# EAGLE design TCA8418 rev B (EAGLE 9.6.2)
COMPANY: ADAFRUIT INDUSTRIES; DRAWN: KTOWN; REV: A
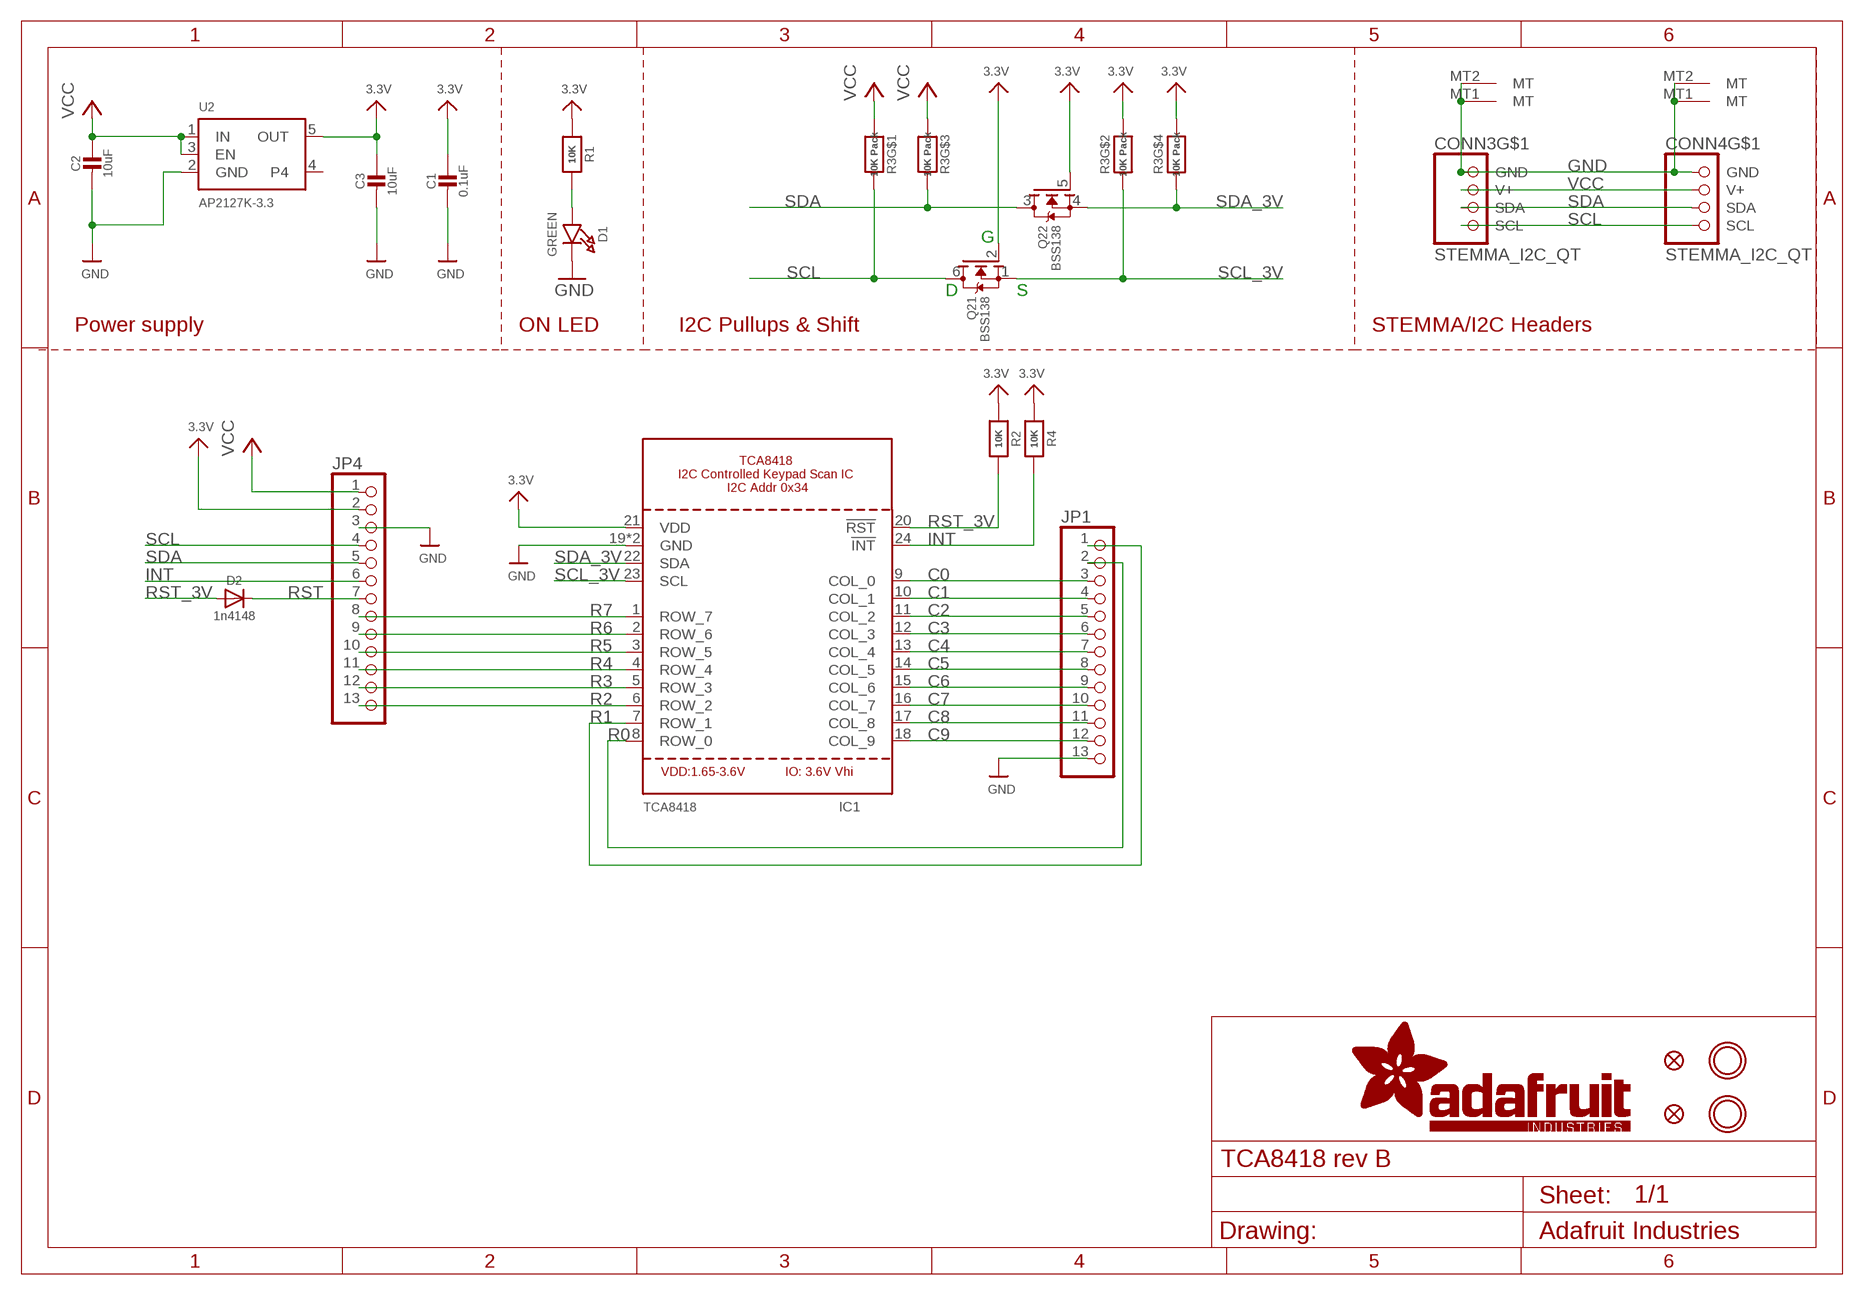
[diagram p0: schematic, sheet 1]

## Parts
C1  0.1uF  CAP_CERAMIC0603_NO  [0603-NO]
C2  10uF  CAP_CERAMIC0805-NOOUTLINE  [0805-NO]
C3  10uF  CAP_CERAMIC0805-NOOUTLINE  [0805-NO]
CONN3  STEMMA_I2C_QT  [JST_SH4]
CONN4  STEMMA_I2C_QT  [JST_SH4]
D1  GREEN  LED0603_NOOUTLINE  [CHIPLED_0603_NOOUTLINE]
D2  1n4148  DIODESOD-323  [SOD-323]
FID3  FIDUCIAL_1MM  [FIDUCIAL_1MM]
FID4  FIDUCIAL_1MM  [FIDUCIAL_1MM]
IC1  TCA8418  [QFN24_4MM_SMSC]
JP1  HEADER-1X13  [1X13_ROUND_70]
JP4  HEADER-1X13  [1X13_ROUND_70]
Q2  BSS138  MOSFET-N_DUAL  [SOT363]
R1  10K  RESISTOR_0603_NOOUT  [0603-NO]
R2  10K  RESISTOR_0603_NOOUT  [0603-NO]
R3  10K Pack  RESISTOR_4PACK  [RESPACK_4X0603]
R4  10K  RESISTOR_0603_NOOUT  [0603-NO]
U2  AP2127K-3.3  VREG_SOT23-5  [SOT23-5]
U$1  MOUNTINGHOLE2.5  [MOUNTINGHOLE_2.5_PLATED]
U$17  MOUNTINGHOLE2.5  [MOUNTINGHOLE_2.5_PLATED]

## Nets
3.3V [lowpower]: C1.1 C3.1 IC1.21(VDD) JP4.2 Q2.2(1:G) Q2.5(2:G) R1.1 R2.1 R3.2 R3.4 R4.1 U2.5(OUT)
C0: IC1.9(COL_0) JP1.3
C1: IC1.10(COL_1) JP1.4
C2: IC1.11(COL_2) JP1.5
C3: IC1.12(COL_3) JP1.6
C4: IC1.13(COL_4) JP1.7
C5: IC1.14(COL_5) JP1.8
C6: IC1.15(COL_6) JP1.9
C7: IC1.16(COL_7) JP1.10
C8: IC1.17(COL_8) JP1.11
C9: IC1.18(COL_9) JP1.12
GND [highpower]: C1.2 C2.2 C3.2 CONN3.1(GND) CONN3.MT1(MT) CONN3.MT2(MT) CONN4.1(GND) CONN4.MT1(MT) CONN4.MT2(MT) D1.C IC1.19(GND) IC1.THERM(GND) JP1.13 JP4.3 U2.2(GND)
INT: IC1.24(!INT) JP4.6 R4.2
N$1: D1.A R1.2
R0: IC1.8(ROW_0) JP1.2
R1: IC1.7(ROW_1) JP1.1
R2: IC1.6(ROW_2) JP4.13
R3: IC1.5(ROW_3) JP4.12
R4: IC1.4(ROW_4) JP4.11
R5: IC1.3(ROW_5) JP4.10
R6: IC1.2(ROW_6) JP4.9
R7: IC1.1(ROW_7) JP4.8
RST: D2.C JP4.7
RST_3V: D2.A IC1.20(!RST) R2.2
SCL: CONN3.4(SCL) CONN4.4(SCL) JP4.4 Q2.6(1:D) R3.8
SCL_3V: IC1.23(SCL) Q2.1(1:S) R3.7
SDA: CONN3.3(SDA) CONN4.3(SDA) JP4.5 Q2.3(2:D) R3.6
SDA_3V: IC1.22(SDA) Q2.4(2:S) R3.5
VCC [highpower]: C2.1 CONN3.2(V+) CONN4.2(V+) JP4.1 R3.1 R3.3 U2.1(IN) U2.3(EN)
Unconnected: U2.4

## Notes on the sheet
- G
- D | S
- Power supply | ON LED | I2C Pullups & Shift | STEMMA/I2C Headers

## Library data of the parts
C1-C3 = microbuilder:CAP_CERAMIC: Ceramic Capacitors For new designs, use the packages preceded by an '_' character since they are more reliable: The following footprints should be used on most boards: _0402 - Standard footprint for regular board layouts _0603 - Standard footprint for regular board layouts _0805 - Standard footprint for regular board layouts _1206 - Standard footprint for regular board layouts For extremely tight-pitch boards where space is at a premium, the following 'micro-pitch' footprints can be used (smaller pads, no silkscreen outline, etc.): _0402MP - Micro-pitch footprint for very dense/compact boards _0603MP - Micro-pitch footprint for very dense/compact boards _0805MP - Micro-pitch footprint for very dense/compact boards _1206MP - Micro-pitch footprint for very dense/compact boards
CONN3 CONN4 = adafruit_electromech:STEMMA_I2C; LCSC: C2845363
D1 = microbuilder:LED: LED 0603 - 0603 Surface Mount Package 2mA: Green LED - Low Power (3.9mcd, 2ma, 1.7Vf) - Digikey: 475-2709-2-ND Orange LED - Low Power (9.8mcd, 2ma, 1.8Vf) - Digikey: 475-1194-2-ND Red LED - Low Power (5mcd, 2ma, 1.8Vf) - Digikey: 475-1195-2-ND Yellow LED - Low Power (7mcd, 2ma, 1.8Vf) - Digikey: 475-1196-2-ND 5mA: Blue LED - Low Power (17mcd, 5ma, 2.9Vf) - Digikey: LNJ937W8CRACT-ND 0805 - 0805 Surface Mount Package 2mA: Red LED (8.8mcd, 2mA, 1.8Vf, Clear) - Low Power [Digikey: 475-2510-1-ND] Green LED (5mcd, 2mA, 1.8Vf, Clear) - Low Power [Digikey: 475-2730-1-ND] Yellow LED (11.3mcd, 2mA, 1.8Vf, Clear) - Low Power [Digikey: 475-2555-1-ND] 20mA: Red LED (104mcd, 20mA, Diffused) - LS R976 [Digikey: 475-1278-6-ND] Red LED (12mcd, 20mA, 2.0Vf, Clear) - APT2012EC [Digikey: 754-1128-1-ND] Green LED (15mcd, 20mA, 2.2Vf, Clear) - APT2012GC [Digikey: 754-1131-1-ND] Orange LED (160mcd, 20mA, 2.1Vf, Clear) - APT2012SECK [Digikey: 754-1130-1-ND] 1206 - 1206 Surface Mount Package Green LED (26mcd, 20mA, Diffused) - LG N971 [Digikey: 475-1407-6-ND] Red LED (15mcd, 20mA, Diffused) - LH N974 [Digikey: 475-1416-6-ND] Cree - Cree High-Power Surface Mount LEDs XPEBWT-L1-0000-00D50 - White 111lm 350mA 2.9Vf 6200K 110° XTEAWT-00-0000-00000LEE3 - White 114lm 350mA 2.85Vf 5000K 115° Everlight - Everlight 45-21 Series Surface Mount LEDs 45-21/QK2C-B2832AC2CB2/2T - Warm White 2000mcd 20mA 3.25Vf 3050K 120° 45-21/LK2C-B38452C4CB2/2T - Nuetral White 2000mcd 20mA 3.25Vf 4150K 120° 45-21/LK2C-B50634C6CB2/2T - Cold White 2200mcd 20mA 3.25Vf 5650K 120° PLCC2 Reverse Mount LS T77K-J1L2-1-0-2-R18-Z - Red 11.25mcd 2mA 1.8Vf 630nm 120° LO T77K-L1M2-24-Z - Orange 19.6mcd 2mA 1.8Vf 606nm 120° LY T77K-K2M1-26-Z - Yellow 15.7mcd 2mA 1.8Vf 587nm 120°; JLC_ROTATION: 270
D2 = microbuilder:DIODE: Diode SMA Model Volts Amps Type Vf Ir Digikey # Notes SSA34-E3 40V 3A Schottky 480mV @ 3A 200uA @ 40V SSA34-E3/61TGITR-ND CDBA120-G 20V 1A Schottky 500mV @ 1A 500uA @ 20V 641-1014-6-ND REEL MBRA210 10V 2A Schottky 350mV @ 2A 700uA @ 10V MBRA210LT3 SOD-123 Model Volts Amps Type Vf Ir Order # Notes BAT54T1G 30V 200mA Schottky 800mV @ 200mA 2uA @ 25V BAT54T1GOSTR-ND B0530W 30V 500mA Schottky 430mV @ 500mA 130uA @ 30V B0530W-FDICT-ND REEL MBR120 20V 1A Schottky 340mV @ 1A MBR120VLSFT1GOSCT-ND SOD-323 Model Volts Amps Type Vf Ir Order # Notes PMEG2005EJ 20V 500mA Schottky 355mV @ 500mA 568-4110-1-ND ZLLS410 10V 570mA Schottky 380mV @ 570mA ZLLS410CT-ND 1N4148WS 75V 150mA Silicon/Simple 1V 1N4148WSFSCT-ND REEL SOD-523 Model Volts Amps Type Vf Ir Order # Notes BAT54XV2 30V 200mA Schottky 0.8V @ 100mA BAT54XV2CT-ND TB751S 30V 30mA Schottky RB751S-40TE61CT-ND SOT23-R/W (R = Solder Paste/Reflow Ovens, W = Hand-Soldering) Model Volts Amps Type Vf Ir Order # Notes BAT54FILM 40V 300mA Schottky 497-7162-1-ND POWERDI-5 Model Volts Amps Type Vf Ir Order # Notes PDS560 60V 5A Schottky 670mV @ 5A 150uA @ 60V PDS560DICT-ND
FID3 FID4 = microbuilder:FIDUCIAL: Fiducial Alignment Points Various fiducial points for machine vision alignment.; BOM: EXCLUDE
IC1 = microbuilder:TCA8418
JP1 JP4 = microbuilder:HEADER-1X13
Q2 = microbuilder:MOSFET-N_DUAL: Dual N-Channel MOSFET SOT363 (2.0x1.25mm) 2N7002PS - 60V, 320mA [Digikey: 568-5984-1-ND]; JLC_ROTATION: 270
R1 R2 R4 = microbuilder:RESISTOR: Resistors For new designs, use the packages preceded by an '_' character since they are more reliable: The following footprints should be used on most boards: _0402 - Standard footprint for regular board layouts _0603 - Standard footprint for regular board layouts _0805 - Standard footprint for regular board layouts _1206 - Standard footprint for regular board layouts For extremely tight-pitch boards where space is at a premium, the following 'micro-pitch' footprints can be used (smaller pads, no silkscreen outline, etc.): _0402MP - Micro-pitch footprint for very dense/compact boards _0603MP - Micro-pitch footprint for very dense/compact boards _0805MP - Micro-pitch footprint for very dense/compact boards _1206MP - Micro-pitch footprint for very dense/compact boards
R3 = microbuilder:RESISTOR_4PACK: Resistor Packs (4 resistors) 4 x 0603 10K 1/16W - Digikey: YC164J-10KCT-ND
U2 = adafruit_power:VREG_SOT23-5: SOT23-5 Fixed Voltage Regulators Part Current Out V Out V In V Dropout θJA (°C/W) TJ (°C) Digikey Part No. ADP121 150mA 3.3V 3.4-5.5V 0.09V @ 150mA -- -- ADP121-AUJZ33R7CT-ND ADP121 150mA 3.0V 3.1-5.5V 0.09V @ 150mA -- -- ADP121-AUJZ30R7CT-ND ADP122 300mA 3.3V 3.4-5.5V 0.085V @ 300mA -- -- ADP122AUJZ-3.3-R7CT-ND ADP1712 300mA 3.3V 3.5-5.5V 0.17V @ 300mA -- -- ADP1712AUJZ-3.3-R7TR-ND AP7311 (Low Cost) 150mA 3.3V 3.5-6V 0.15V @ 150mA -- -- AP7311-33WG-7DICT-ND LD39015M18R 150mA 1.8V 1.9V-5.5V 0.08V @ 100mA -- -- 497-6977-1-ND LP2985A-33DBVR 150mA 3.3V 3.3-16V 0.28V @ 150mA 206 150 296-18479-1-ND MCP1824T-3302E/OT 300mA 3.3V 3.5V-6V 0.2V @ 300mA -- -- MCP1824T-3302E/OTCT-ND MIC5205-2.5YM5 TR 150mA 2.5V 2.7-16V 0.165V @ 150mA -- -- 576-1257-2-ND MIC5205-3.0YM5 TR 150mA 3.0V 3.2V-16V 0.165V @ 150mA -- -- 576-1258-2-ND MIC5205-3.3YM5 TR 150mA 3.3V 3.5V-16V 0.165V @ 150mA -- -- 576-1259-2-ND TPS780330220 150mA 3.3V+2.2V 3.6-5.5V 250mV Max -- -- 296-23332-1-ND TDA3663/N1,135 100mA 3.3V 3.5-45V 0.18V @ 50mA -- -- 568-5343-1-ND Max operating temp can be calculated using θJA, TJ (max junction temperature), and power in watts. Set the "Maximum Ambient Temperature" until it reaches TJ ("Max Junction Temperature"), which is the absolute limit for safe use of the regulator: Heat Sink Temperature Calculator <http://www.daycounter.com/Calculators/Heat-Sink-Temperature-Calculator.phtml> For example, With 12V source into a 3.3V LP2985 and a 30mA load, we are dissipating (12V-3.3V) * 0.03A = 0.261W. With a θJA of 206 °C/W, a TJ of 150°C, and 261mW we can safely use the chip without a heat sink up to 75°C (=147.1°C Junction Temperature).; JLC_ROTATION: 270
U$1 U$17 = adafruit_electromech:MOUNTINGHOLE: Mounting Hole For #2 screws (0.086"/2.18mm width, 0.094"/2.4mm hole) use 2.5mm; BOM: EXCLUDE

## Net classes
1 highpower: width 0.305 mm, drill 0.483 mm
2 lowpower: width 0.254 mm, drill 0.483 mm

## Board
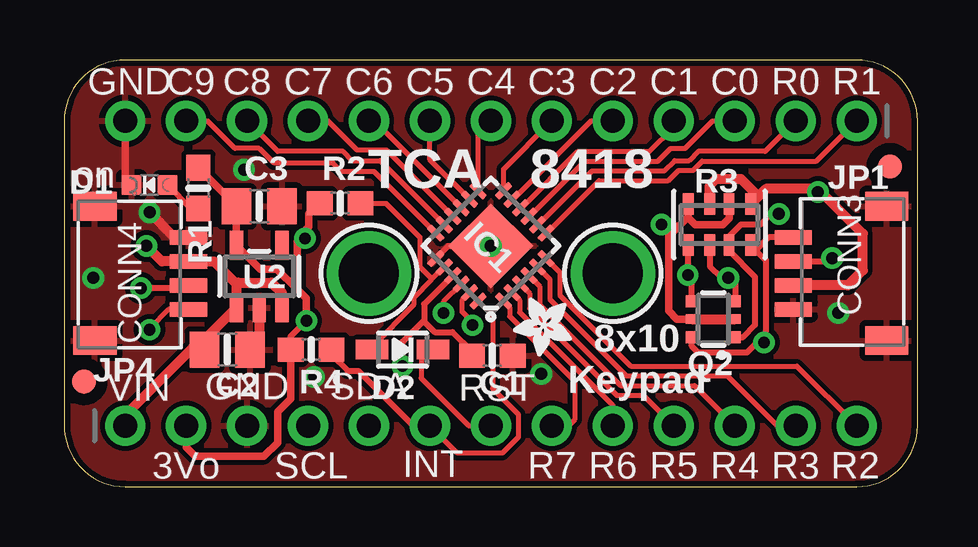
[diagram p1: board, top side]
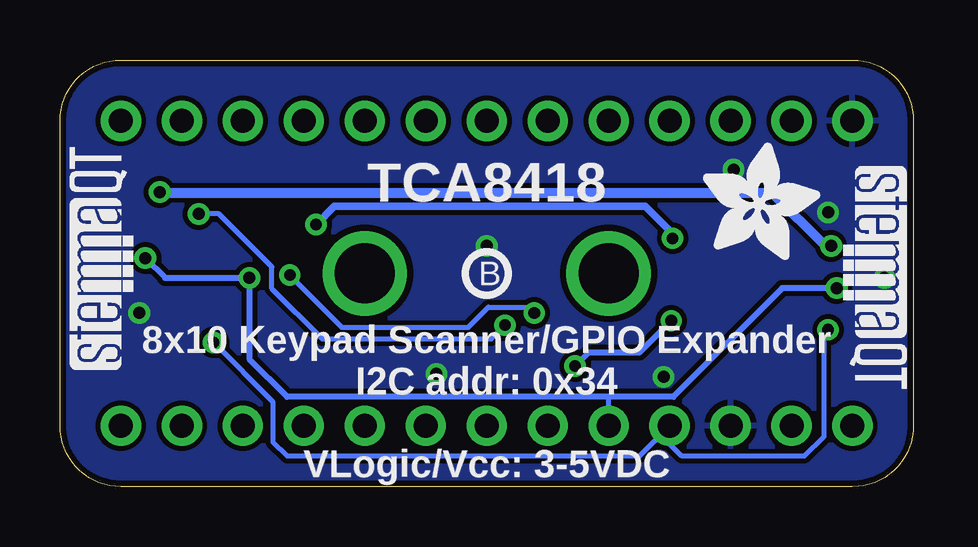
[diagram p2: board, bottom side, seen from below]

Size 35.56 x 17.78 mm. Coordinates in mm from the lower left corner, seen from the top.
Outline: 0,15.24 0,2.54 arc90 2.54,0 33.02,0 arc90 35.56,2.54 35.56,15.24 arc90 33.02,17.78 2.54,17.78 arc90 0,15.24
Copper layers (1*16): Top 0.035mm / dielectric 1.5mm / Bottom 0.035mm
Design rules "adafruit *": minimum track width 8mil, minimum drill 15.5mil, track to track 8mil, track to pad 8mil, pad to pad 8mil, via to via 8mil, smd to smd 8mil, copper to edge 10mil, drill to drill 8mil, minimum pad ring 10mil, minimum via ring 8mil, stop-mask expansion 2mil, vias tented up to drill 20mil, thermal gap 10mil

### Footprints (pad centres in the part's own frame; a part is rotated, then mirrored left to right if it is on the bottom)
0603-NO = smd 1.075 x 1: 1 -0.85,0; 2 0.85,0
0805-NO = smd 1.24 x 1.5: 1 -0.95,0; 2 0.95,0
JST_SH4 = smd 0.6 x 1.55: 1 -1.5,2.006; 2 -0.5,2.006; 3 0.5,2.006; 4 1.5,2.006 | smd 1.2 x 1.8: MT1 -2.8,-1.894; MT2 2.8,-1.894
CHIPLED_0603_NOOUTLINE = smd 0.8 x 0.8: A 0,-0.75; C 0,0.75
SOD-323 = smd 1.35 x 0.8: A 1.27,0; C -1.27,0
FIDUCIAL_1MM = smd 1 x 1: 1 0,0
QFN24_4MM_SMSC = smd 0.8 x 0.28: 1 -2,1.25; 2 -2,0.75; 3 -2,0.25; 4 -2,-0.25; 5 -2,-0.75; 6 -2,-1.25; 13 2,-1.25; 14 2,-0.75; 15 2,-0.25; 16 2,0.25; 17 2,0.75; 18 2,1.25 | smd 0.28 x 0.8: 7 -1.25,-2; 8 -0.75,-2; 9 -0.25,-2; 10 0.25,-2; 11 0.75,-2; 12 1.25,-2; 19 1.25,2; 20 0.75,2; 21 0.25,2; 22 -0.25,2; 23 -0.75,2; 24 -1.25,2 | smd 2.5 x 2.5: THERM 0,0
1X13_ROUND_70 = drill 1 pad 1.676: 1 -15.24,0; 2 -12.7,0; 3 -10.16,0; 4 -7.62,0; 5 -5.08,0; 6 -2.54,0; 7 0,0; 8 2.54,0; 9 5.08,0; 10 7.62,0; 11 10.16,0; 12 12.7,0; 13 15.24,0
SOT363 = smd 0.5 x 0.5: 1 -0.75,-0.9; 3 0.75,-0.9; 4 0.75,0.9; 6 -0.75,0.9 | smd 0.4 x 0.5: 2 0,-0.9; 5 0,0.9
RESPACK_4X0603 = smd 0.45 x 0.9: 1 -1.3,-0.85; 2 -0.4,-0.85; 3 0.4,-0.85; 4 1.3,-0.85; 5 1.3,0.85; 6 0.4,0.85; 7 -0.4,0.85; 8 -1.3,0.85
SOT23-5 = smd 0.55 x 1.2: 1 -0.95,-1.3; 2 0,-1.3; 3 0.95,-1.3; 4 0.95,1.3; 5 -0.95,1.3
MOUNTINGHOLE_2.5_PLATED = drill 2.5 pad 3.2: P$1 0,0

### Placement (x,y rotation side)
C1  17.84,5.46 0 top
C2  6.79,5.71 0 top
C3  8.13,11.68 0 top
CONN3  32.38,8.89 90 top
CONN4  3.17,8.89 270 top
D1  3.56,12.57 90 top
D2  14.1,5.71 180 top
FID3  0.83,4.38 0 top
FID4  34.42,13.34 0 top
IC1  17.78,10.03 135 top
JP1  17.78,15.24 180 top
JP4  17.78,2.54 0 top
Q2  27.05,6.99 90 top
R1  5.59,12.45 270 top
R2  11.49,11.81 0 top
R3  27.3,10.92 180 top
R4  10.29,5.71 0 top
U2  8.13,8.76 0 top
U$1  12.7,8.89 0 top
U$12  [PCBFEAT-REV-040]  17.78,8.89 0 bottom
U$17  22.86,8.89 0 top
U$19  [ADAFRUIT_5MM]  8.76,9.46 0 bottom
U$20  [ADAFRUIT_2.5MM]  21.15,7.87 180 top
U$30  [STEMMAQT]  32.51,4.89 90 bottom
U$31  [STEMMAQT]  2.92,13.34 270 bottom

### Tracks (layer width: path | path; a pad name or v marks a point on that pad's centre or on a via)
3.3V  (via drill 0.48)
  Top 0.254: IC1.21 15,7.6 15,6.95 | 15,6.95 15,6.88 15.43,6.45 16.18,6.45 16.99,5.63 C1.1 | R4.1 9.44,6.26 v10.09,6.92 | v14.1,5.03 14.1,6.04 15,6.95
  Top 0.305: R3.2 27.7,11.2 27.43,10.92 26.29,10.92 26,11.21 R3.4 26,11.25 25.54,10.78 | R1.1 7.18,11.71 C3.1 U2.5 8.17,9.07 8.87,9.07 9.72,8.22 | v10.09,6.92 10.09,7.84 9.72,8.22 | 25.54,10.78 25.18,10.43 25.18,7.33 25.53,6.99 26.42,6.99 | 25.54,10.78 25.4,10.92 v24.89,10.92 | 9.72,8.22 9.72,10.22 9.84,10.35 v10.03,10.35 10.03,10.67 10.2,10.83 10.2,11.37 R2.1 | JP4.2 5.08,1.65 5.46,1.27 8.32,1.27 8.89,1.84 8.89,3.12 9.44,3.67 R4.1
  Top 0.406: Q2.5 26.42,6.99 Q2.2
  Bottom 0.254: v14.1,5.03 13.53,5.6 11.4,5.6 v10.09,6.92
  Bottom 0.305: v24.89,10.92 24.13,11.68 11.18,11.68 10.03,10.54 v10.03,10.35
C0
  Top 0.203: IC1.9 19.41,11.27 21.7,13.56 24.74,13.56 25.27,14.1 25.87,14.1 27.02,15.24 JP1.3
C1
  Top 0.203: IC1.10 19.06,11.62 21.4,13.97 24.38,13.97 25.4,14.99 JP1.4
C2
  Top 0.203: JP1.5 21.97,15.24 18.71,11.98 IC1.11
C3
  Top 0.203: IC1.12 18.31,13.23 JP1.6
C4
  Top 0.203: IC1.13 17.25,14.71 JP1.7
C5
  Top 0.203: IC1.14 15.24,13.63 JP1.8
C6
  Top 0.203: IC1.15 12.93,15.24 JP1.9
C7
  Top 0.203: IC1.16 13.44,14.02 12.21,14.02 10.99,15.24 JP1.10
C8
  Top 0.203: JP1.11 8.89,13.97 11.62,13.97 12,13.59 13.16,13.59 IC1.17
C9
  Top 0.203: JP1.12 5.97,15.24 7.11,14.1 8.13,14.1 8.72,13.5 11.2,13.5 11.56,13.14 12.9,13.14 IC1.18
GND  (via drill 0.5)
  Top 0.254: IC1.19 16.01,10.03 IC1.THERM
  Top 0.305: JP1.13 2.54,12.84 D1.C
  Top 0.406: U2.2 8.13,6.1 C2.2 | CONN4.1 4.6,10.39 v3.56,11.43
  other vias: 32.26,7.24 17.78,10.03 1.21,8.7 7.49,13.21 10.41,4.57 19.88,4.7
  pour Top: 0,17.78 35.56,17.78 35.56,0 0,0
  pour Bottom: 0,17.78 35.56,17.78 35.56,0 0,0
INT
  Top 0.203: JP4.6 16.38,1.4 18.25,1.4 18.92,2.07 18.92,3.01 17.85,4.08 17.85,7.13 IC1.24
  Top 0.254: R4.2 11.14,5.5 11.81,4.83 12.26,4.83 14.54,2.54 JP4.6
N$1
  Top 0.254: D1.A 5.28,11.6 R1.2
R0
  Top 0.203: IC1.8 19.75,10.92 21.99,13.16 25,13.16 25.43,13.59 26.04,13.59 26.42,13.97 29.21,13.97 JP1.2
R1
  Top 0.203: IC1.7 20.1,10.56 22.29,12.75 25.17,12.75 25.6,13.18 26.2,13.18 26.58,13.56 31.34,13.56 JP1.1
R2
  Top 0.203: IC1.6 20.65,8.93 20.65,7.98 23.6,5.03 30.53,5.03 JP4.13
R3
  Top 0.203: IC1.5 20.23,8.64 20.23,7.82 23.43,4.62 27.64,4.62 29.72,2.54 JP4.12
R4
  Top 0.203: IC1.4 19.82,8.35 19.82,7.59 23.19,4.22 26.26,4.22 JP4.11
R5
  Top 0.203: IC1.3 19.4,8.06 19.4,7.43 23.01,3.81 24.13,3.81 JP4.10
R6
  Top 0.203: IC1.2 18.98,7.77 18.98,7.26 22.86,3.38 JP4.9
R7
  Top 0.203: IC1.1 18.56,7.48 18.56,7.1 21.27,4.39 21.27,2.79 21.02,2.54 JP4.8
RST
  Top 0.203: D2.C 15.11,5.71 14.87,5.47 14.87,4.53 16.86,2.54 JP4.7
RST_3V
  Top 0.203: IC1.20 15.28,8.6 | 15.28,8.6 14.56,7.88 14.56,7.58 12.83,5.84 D2.A | R2.2 13.41,11.81 14.82,10.39 14.82,9.16 15.28,8.71 15.28,8.6
SCL  (via drill 0.48)
  Top 0.203: CONN4.4 4.34,7.39 3.56,6.61 v3.56,6.54 | v29.16,6.02 29.11,6.07 29.11,6.25
  Top 0.254: CONN3.4 29.36,10.39 28.86,9.88 28.8,9.88 R3.8 29.24,9.44 29.24,6.38 29.11,6.25 28.45,5.59 26.42,5.59 26.15,5.85 Q2.6
  Bottom 0.203: v29.16,6.02 26.69,3.54 26.69,1.86 26.1,1.27 11.43,1.27 JP4.4 10.16,1.78 9.65,1.27 4.54,1.27 3.75,2.07 3.75,6.35 v3.56,6.54
SCL_3V  (via drill 0.48, 0.5)
  Top 0.203: IC1.23 16.57,7.77 16.57,7.3 17.02,6.86 v17.02,6.73
  Top 0.254: v29.78,11.37 29.46,11.37 29.02,10.92 28.19,10.92 27.7,10.43 R3.7 27.7,9.82 28.78,8.75 28.78,6.73 28.29,6.24 Q2.1
  Bottom 0.203: v17.02,6.73 17.59,6.16 24.64,6.16 26.73,8.26 26.73,9.15 28.95,11.37 v29.78,11.37
SDA  (via drill 0.5)
  Top 0.254: R3.6 26.91,9.18 27.39,8.7 v27.67,8.7 27.67,8.62 27.95,8.62 Q2.3 | CONN4.3 5.56,8.26 3.2,8.26 v3.2,8.28 | v32,9.53 31.89,9.41 31.9,9.39 CONN3.3
  Bottom 0.203: JP4.5 12.7,3.75
  Bottom 0.254: v3.2,8.28 5.47,8.28 10.01,3.75 12.7,3.75 26.1,3.75 27.67,5.32 v27.67,8.7 31.18,8.7 v32,9.53
SDA_3V  (via drill 0.48)
  Top 0.203: IC1.22 15.8,7.7 v15.8,7.24 | v25.98,8.82 26,8.82 26,8.9
  Top 0.254: Q2.4 26.15,8.75 26,8.9 R3.5
  Bottom 0.203: v15.8,7.24 16.04,7.48 17.71,7.48 18.56,6.63 23.79,6.63 v25.98,8.82
VCC  (via drill 0.5)
  Top 0.406: R3.3 26.91,12.55 27.18,12.83 28.19,12.83 28.93,12.09 | 7.18,8.45 7.24,8.51 8.64,8.51 9.08,8.07 U2.3 | 7.18,8.45 U2.1 5.84,6.13 C2.1 5.72,5.84 5.4,5.84 2.54,2.98 JP4.1 | 7.18,8.45 6.24,9.39 CONN4.2 4.07,9.39 v3.43,10.03 | CONN3.2 32.65,8.39 33.27,9.02 33.27,10.54 31.54,12.28 v31.41,12.28 31.28,12.41 29.24,12.41 28.93,12.09 | R3.1 28.93,12.09
  Bottom 0.406: v3.43,10.03 3.68,10.03 5.91,12.26 31.19,12.26 31.22,12.28 v31.41,12.28

### Text on the board
tPlace: GND | C9 | C8 | C7 | C6 | C5 | C4 | C3 | C2 | C1 | C0 | R0 | R1 | TCA 8418 | on | 8x10 / Keypad | VIN | GND | SDA | RST | 3Vo | SCL | INT | R7 | R6 | R5 | R4 | R3 | R2
bPlace: TCA8418 | 8x10 Keypad Scanner/GPIO Expander / I2C addr: 0x34 | VLogic/Vcc: 3-5VDC